# Altium schematic sheet POWER.SchDoc
size A4
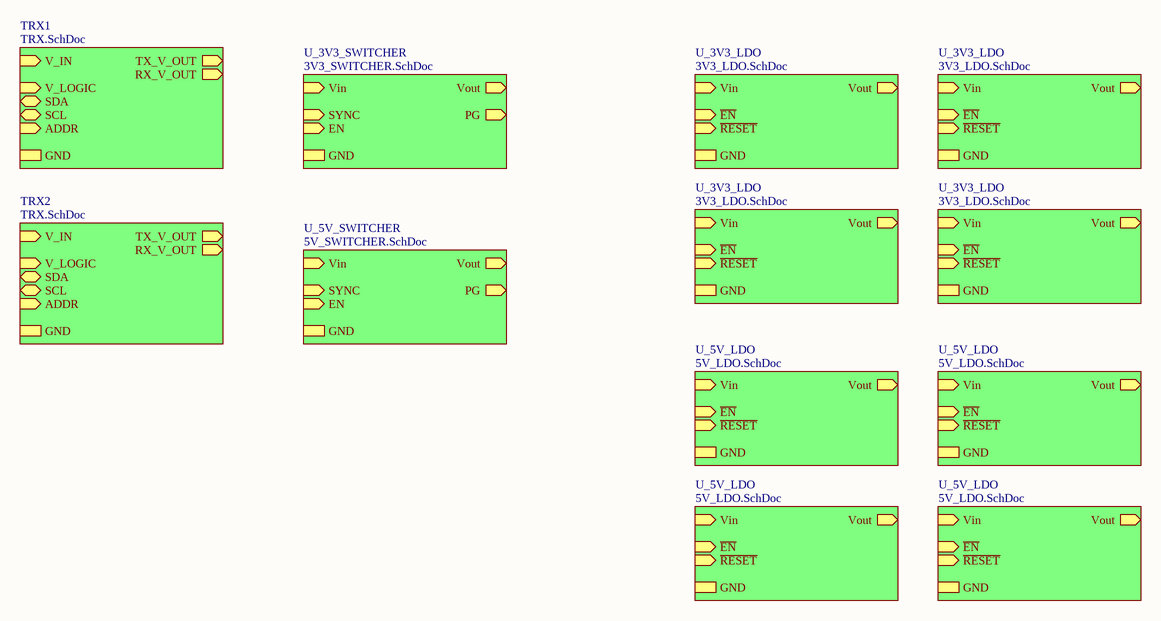
[diagram p0: POWER.SchDoc]

## Sub-sheets
TRX1 = TRX.SchDoc: V_IN (in), TX_V_OUT (out), RX_V_OUT (out), V_LOGIC (in), SCL (bidir), SDA (bidir), GND, ADDR (in)
TRX2 = TRX.SchDoc: V_IN (in), TX_V_OUT (out), RX_V_OUT (out), V_LOGIC (in), SCL (bidir), SDA (bidir), GND, ADDR (in)
U_3V3_LDO = 3V3_LDO.SchDoc: Vout (out), ~{EN} (in), ~{RESET} (in), Vin (in), GND
U_3V3_LDO = 3V3_LDO.SchDoc: Vout (out), ~{EN} (in), ~{RESET} (in), Vin (in), GND
U_3V3_LDO = 3V3_LDO.SchDoc: Vout (out), ~{EN} (in), ~{RESET} (in), Vin (in), GND
U_3V3_LDO = 3V3_LDO.SchDoc: Vout (out), ~{EN} (in), ~{RESET} (in), Vin (in), GND
U_3V3_SWITCHER = 3V3_SWITCHER.SchDoc: PG (out), Vout (out), EN (in), Vin (in), SYNC (in), GND
U_5V_LDO = 5V_LDO.SchDoc: Vout (out), ~{EN} (in), ~{RESET} (in), Vin (in), GND
U_5V_LDO = 5V_LDO.SchDoc: Vout (out), ~{EN} (in), ~{RESET} (in), Vin (in), GND
U_5V_LDO = 5V_LDO.SchDoc: Vout (out), ~{EN} (in), ~{RESET} (in), Vin (in), GND
U_5V_LDO = 5V_LDO.SchDoc: Vout (out), ~{EN} (in), ~{RESET} (in), Vin (in), GND
U_5V_SWITCHER = 5V_SWITCHER.SchDoc: PG (out), Vout (out), EN (in), Vin (in), SYNC (in), GND